# EAGLE design PCC_hat3 (EAGLE 9.2.2)
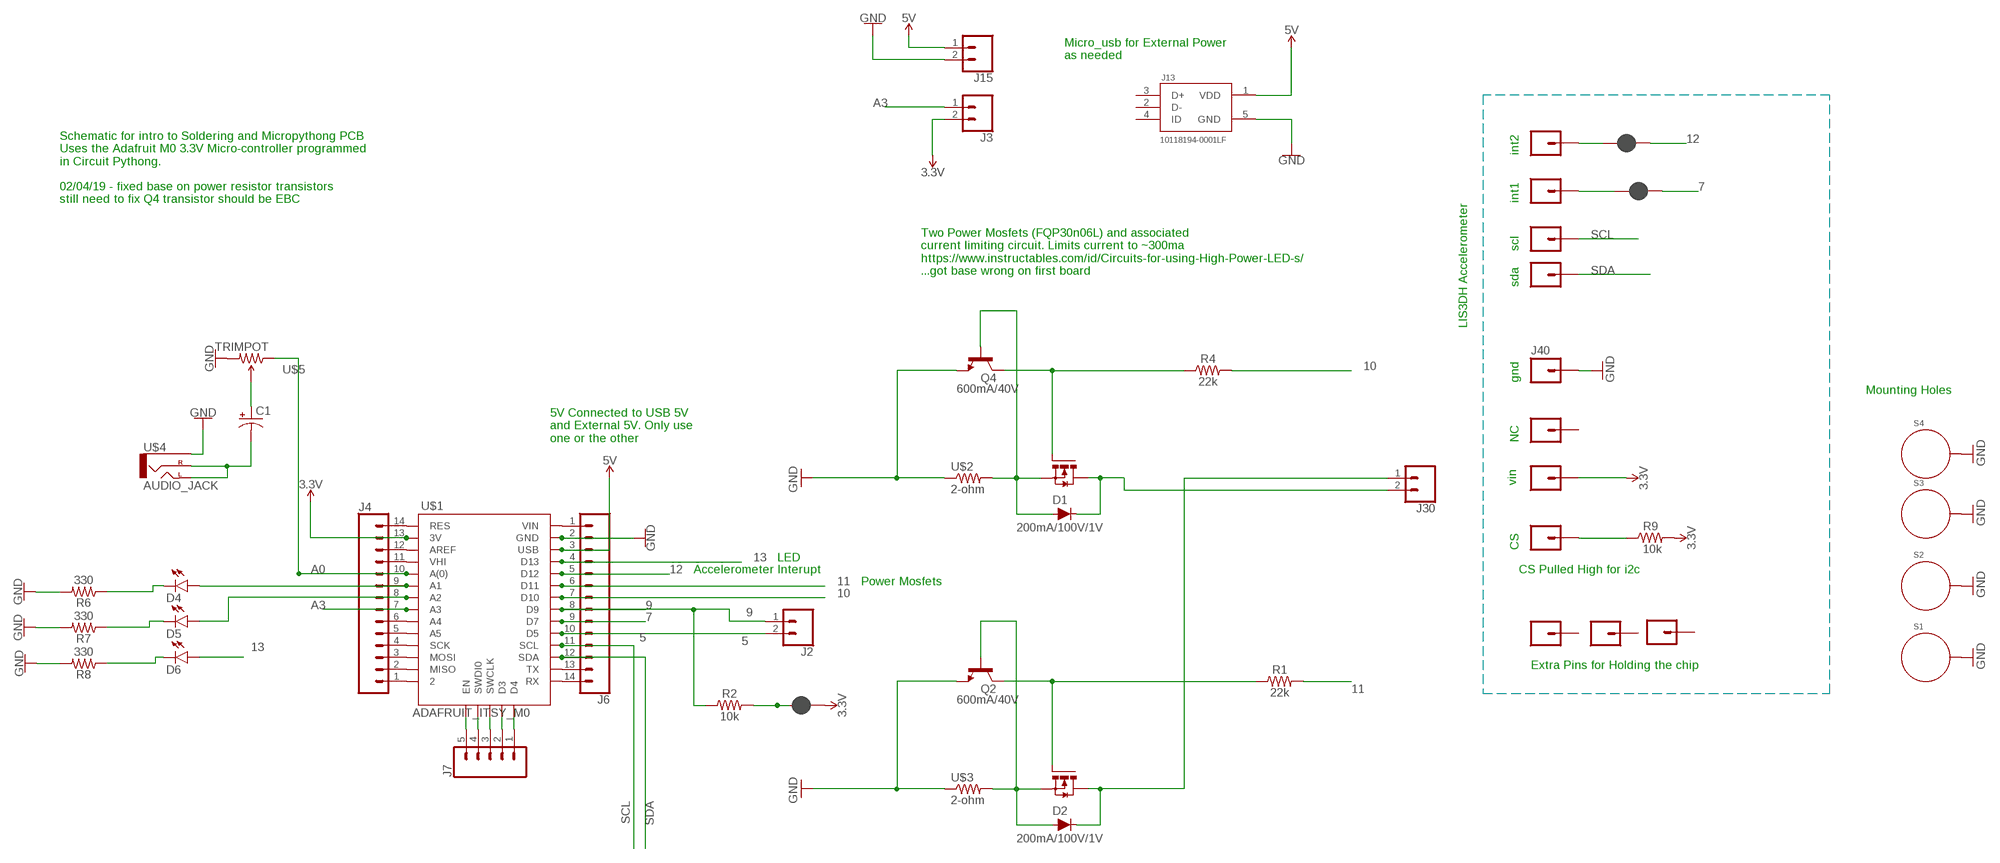
[diagram p0: schematic, sheet 1]

## Parts
C1  CAP_POLPTH1  [CPOL-RADIAL-100UF-25V]
D1  200mA/100V/1V  DIODE-KIT  [DIODE-1N4148-KIT]
D2  200mA/100V/1V  DIODE-KIT  [DIODE-1N4148-KIT]
D4  LED5MM  [LED5MM]
D5  LED5MM  [LED5MM]
D6  LED5MM  [LED5MM]
J2  CONN_025MM  [SCREWTERMINAL-5MM-2]
J3  CONN_025MM  [SCREWTERMINAL-5MM-2]
J4  CONN_14  [1X14]
J5  M01PTH  [1X01]
J6  CONN_14  [1X14]
J7  CONN_05  [1X05]
J8  M01PTH  [1X01]
J9  M01PTH  [1X01]
J10  M01PTH  [1X01]
J11  M01PTH  [1X01]
J12  M01PTH  [1X01]
J13  10118194-0001LF  [FRAMATOME_10118194-0001LF]
J15  CONN_025MM  [SCREWTERMINAL-5MM-2]
J30  CONN_025MM  [SCREWTERMINAL-5MM-2]
J39  M01PTH  [1X01]
J40  M01PTH  [1X01]
J42  M01PTH  [1X01]
J43  M01PTH  [1X01]
J44  M01PTH  [1X01]
JP1  JUMPER-SMT_2_NC_PASTE_SILK  [SMT-JUMPER_2_NC_PASTE_SILK]
JP2  JUMPER-SMT_2_NC_PASTE_SILK  [SMT-JUMPER_2_NC_PASTE_SILK]
JP3  JUMPER-SMT_2_NC_PASTE_SILK  [SMT-JUMPER_2_NC_PASTE_SILK]
Q1  IRFI540NPBF  [TO220BH]
Q2  600mA/40V  TRANS_NPN-P2N2222A  [TO-92]
Q3  IRFI540NPBF  [TO220BH]
Q4  600mA/40V  TRANS_NPN-P2N2222A  [TO-92]
R1  22k  RESISTORAXIAL-0.3-KIT  [AXIAL-0.3-KIT]
R2  10k  RESISTORAXIAL-0.3-KIT  [AXIAL-0.3-KIT]
R4  22k  RESISTORAXIAL-0.3-KIT  [AXIAL-0.3-KIT]
R6  330  RESISTORAXIAL-0.3-KIT  [AXIAL-0.3-KIT]
R7  330  RESISTORAXIAL-0.3-KIT  [AXIAL-0.3-KIT]
R8  330  RESISTORAXIAL-0.3-KIT  [AXIAL-0.3-KIT]
R9  10k  RESISTORAXIAL-0.3-KIT  [AXIAL-0.3-KIT]
S1  STANDOFF_ELECTRICAL  [STANDOFF-ELECTRICAL]
S2  STANDOFF_ELECTRICAL  [STANDOFF-ELECTRICAL]
S3  STANDOFF_ELECTRICAL  [STANDOFF-ELECTRICAL]
S4  STANDOFF_ELECTRICAL  [STANDOFF-ELECTRICAL]
U$1  ADAFRUIT_ITSY_M0  [ADAFRUIT_ITS_M0]
U$2  2-ohm  RESISTOR  [RESISTOR_5W_PT]
U$3  2-ohm  RESISTOR  [RESISTOR_5W_PT]
U$4  AUDIO_JACK  [1/8"AUDIO_JACK]
U$5  TRIMPOT  [1X03_TRIMPOT]

## Nets
3.3V: J3.2 J4.13 J5.1 JP3.2 R9.P$2 U$1.3V
5: J2.2 J6.10 U$1.D5
5V: J6.3 J13.1(VDD) J15.1 U$1.USB
7: J6.9 JP1.2 U$1.D7
9: J2.1 J6.8 R2.P$1 U$1.D9
10: J6.7 R4.P$2 U$1.D10
11: J6.6 R1.P$2 U$1.D11
12: J6.5 JP2.2 U$1.D12
13: D6.A J6.4 U$1.D13
A0: J4.10 U$1.A0(A(0)) U$5.1(CCW)
A3: J3.1 J4.7 U$1.A3
EXTERNAL_5V: J6.1 U$1.VIN
GND: J6.2 J13.5(GND) J15.2 J40.1 Q2.3(E) Q4.3(E) R6.P$2 R7.P$2 R8.P$2 S1.P1 S2.P1 S3.P1 S4.P1 U$1.GND U$2.P$1 U$3.P$1 U$4.GND(SLEEVE) U$5.3(CW)
N$1: JP3.1 R2.P$2
N$2: D4.K(C) R6.P$1
N$3: J7.1 U$1.D4
N$4: C1.2(-) U$4.LEFT_TIP_1(LEFT) U$4.RIGHT
N$5: J4.2 U$1.MISO
N$6: J4.3 U$1.MOSI
N$7: J4.4 U$1.SCK
N$8: J4.5 U$1.A5
N$9: J4.6 U$1.A4
N$10: C1.1(+) U$5.2(WIPER)
N$11: D5.A J4.8 U$1.A2
N$12: D4.A J4.9 U$1.A1
N$13: D5.K(C) R7.P$1
N$14: J4.11 U$1.VHI
N$15: J4.12 U$1.AREF
N$16: J4.14 U$1.RES
N$17: D2.C J30.1 Q1.D
N$18: D1.A Q3.S Q4.2(B) U$2.P$2
N$19: J11.1 JP2.1
N$20: D6.K(C) R8.P$1
N$21: J6.13 U$1.TX
N$22: J6.14 U$1.RX
N$23: J7.2 U$1.3(D3)
N$24: J7.3 U$1.SWCLK
N$25: J7.4 U$1.SWDI0
N$26: J7.5 U$1.EN
N$27: J44.1 JP1.1
N$28: J8.1 R9.P$1
N$30: D2.A Q1.S Q2.2(B) U$3.P$2
N$31: Q3.G Q4.1(C) R4.P$1
N$32: Q1.G Q2.1(C) R1.P$1
N$33: J4.1 U$1.2
N$71: D1.C J30.2 Q3.D
SCL: J6.11 J43.1 U$1.SCL
SDA: J6.12 J42.1 U$1.SDA
Unconnected: J9.1 J10.1 J12.1 J13.2(D-) J13.3(D+) J13.4(ID) J39.1

## Notes on the sheet
- Micro_usb for External Power
  as needed
- int2
- Schematic for intro to Soldering and Micropythong PCB
  Uses the Adafruit M0 3.3V Micro-controller programmed
  in Circuit Pythong.
  
  02/04/19 - fixed base on power resistor transistors
  still need to fix Q4 transistor should be EBC
- LIS3DH Accelerometer | int1
- scl
- Two Power Mosfets (FQP30n06L) and associated 
  current limiting circuit. Limits current to ~300ma
  https://www.instructables.com/id/Circuits-for-using-High-Power-LED-s/
  ...got base wrong on first board
- sda
- gnd
- Mounting Holes
- 5V Connected to USB 5V 
  and External 5V. Only use
  one or the other
- NC
- vin
- CS
- LED
- Accelerometer Interupt | CS Pulled High for i2c
- Power Mosfets
- Extra Pins for Holding the chip

## Library data of the parts
C1 = SparkFun-Passives:CAP_POL: Capacitor Polarized These are standard SMD and PTH capacitors. Normally 10uF, 47uF, and 100uF in electrolytic and tantalum varieties. Always verify the external diameter of the through hole cap, it varies with capacity, voltage, and manufacturer. The EIA devices should be standard.
D1 D2 = SparkFun-DiscreteSemi:DIODE: Diode These are standard reverse protection diodes and small signal diodes. SparkFun Products: SparkFun SparkPunk Sound Kit <https://www.sparkfun.com/products/11177> SparkFun ESP8266 Thing <https://www.sparkfun.com/products/13231>; PROD_ID: DIO-08378
D4-D6 = SparkFun-LED:LED: LEDs Standard schematic elements and footprints for 5mm, 3mm, 1206, and 0603 sized LEDs. 5mm - Spark Fun Electronics SKU : COM-00529 (and others)
J2 J3 J15 J30 = SparkFun-Connectors:CONN_02: Multi connection point. Often used as Generic Header-pin footprint for 0.1 inch spaced/style header connections On any of the 0.1 inch spaced packages, you can populate with these: Break Away Headers - Straight <https://www.sparkfun.com/products/116> (PRT-00116) Break Away Male Headers - Right Angle <https://www.sparkfun.com/products/553> (PRT-00553) Female Headers <https://www.sparkfun.com/products/115> (PRT-00115) Break Away Headers - Machine Pin <https://www.sparkfun.com/products/117> (PRT-00117) Break Away Female Headers - Swiss Machine Pin <https://www.sparkfun.com/products/743> (PRT-00743) For SCREWTERMINALS and SPRING TERMINALS visit here: Screw Terimnals on SparkFun.com <https://www.sparkfun.com/search/results?term=Screw+Terminals> (5mm/3.5mm/2.54mm spacing) This device is also useful as a general connection point to wire up your design to another part of your project. Our various solder wires solder well into these plated through hole pads. Hook-Up Wire - Assortment (Stranded, 22 AWG) <https://www.sparkfun.com/products/11375> (PRT-11375) Hook-Up Wire - Assortment (Solid Core, 22 AWG) <https://www.sparkfun.com/products/11367> (PRT-11367) View the entire wire category on our website here <https://www.sparkfun.com/categories/141> Special notes: Molex polarized connector foot print use with: PRT-08233 with associated crimp pins and housings. 2.54_SCREWTERM for use with PRT-10571. 3.5mm Screw Terminal footprints for PRT-08084 5mm Screw Terminal footprints for use with PRT-08432; SF_SKU: PRT-08432
J4 J6 = SparkFun-Connectors:CONN_14: Multi connection point. Often used as Generic Header-pin footprint for 0.1 inch spaced/style header connections On any of the 0.1 inch spaced packages, you can populate with these: Break Away Headers - Straight <https://www.sparkfun.com/products/116> (PRT-00116) Break Away Male Headers - Right Angle <https://www.sparkfun.com/products/553> (PRT-00553) Female Headers <https://www.sparkfun.com/products/115> (PRT-00115) Break Away Headers - Machine Pin <https://www.sparkfun.com/products/117> (PRT-00117) Break Away Female Headers - Swiss Machine Pin <https://www.sparkfun.com/products/743> (PRT-00743) For SCREWTERMINALS and SPRING TERMINALS visit here: Screw Terimnals on SparkFun.com <https://www.sparkfun.com/search/results?term=Screw+Terminals> (5mm/3.5mm/2.54mm spacing) This device is also useful as a general connection point to wire up your design to another part of your project. Our various solder wires solder well into these plated through hole pads. Hook-Up Wire - Assortment (Stranded, 22 AWG) <https://www.sparkfun.com/products/11375> (PRT-11375) Hook-Up Wire - Assortment (Solid Core, 22 AWG) <https://www.sparkfun.com/products/11367> (PRT-11367) View the entire wire category on our website here <https://www.sparkfun.com/categories/141> Special notes: Molex polarized connector foot print use with SKU : PRT-08231 with associated crimp pins and housings. 1MM SMD Version SKU: PRT-10208 NOTES ON THE VARIANTS LOCK and LOCK_LONGPADS... This footprint was designed to help hold the alignment of a through-hole component (i.e. 6-pin header) while soldering it into place. You may notice that each hole has been shifted either up or down by 0.005 of an inch from it's more standard position (which is a perfectly straight line). This slight alteration caused the pins (the squares in the middle) to touch the edges of the holes. Because they are alternating, it causes a "brace" to hold the component in place. 0.005 has proven to be the perfect amount of "off-center" position when using our standard breakaway headers. Although looks a little odd when you look at the bare footprint, once you have a header in there, the alteration is very hard to notice. Also,if you push a header all the way into place, it is covered up entirely on the bottom side.
J5 J8-J12 J39 J40 J42-J44 = SparkFun-Connectors:M01: Header 1 Standard 1-pin 0.1" header. Use with straight break away headers (SKU : PRT-00116), right angle break away headers (PRT-00553), swiss pins (PRT-00743), machine pins (PRT-00117), and female headers (PRT-00115). SMTSO-256-ET is a "flush mount" nut for a 4-40 screw. The older package used to be too tight, and did not allow it to sit properly thru the drill hit. The latest (0.165DIA) fits nice and snug.
J7 = SparkFun-Connectors:CONN_05: Multi connection point. Often used as Generic Header-pin footprint for 0.1 inch spaced/style header connections On any of the 0.1 inch spaced packages, you can populate with these: Break Away Headers - Straight <https://www.sparkfun.com/products/116> (PRT-00116) Break Away Male Headers - Right Angle <https://www.sparkfun.com/products/553> (PRT-00553) Female Headers <https://www.sparkfun.com/products/115> (PRT-00115) Break Away Headers - Machine Pin <https://www.sparkfun.com/products/117> (PRT-00117) Break Away Female Headers - Swiss Machine Pin <https://www.sparkfun.com/products/743> (PRT-00743) For SCREWTERMINALS and SPRING TERMINALS visit here: Screw Terimnals on SparkFun.com <https://www.sparkfun.com/search/results?term=Screw+Terminals> (5mm/3.5mm/2.54mm spacing) This device is also useful as a general connection point to wire up your design to another part of your project. Our various solder wires solder well into these plated through hole pads. Hook-Up Wire - Assortment (Stranded, 22 AWG) <https://www.sparkfun.com/products/11375> (PRT-11375) Hook-Up Wire - Assortment (Solid Core, 22 AWG) <https://www.sparkfun.com/products/11367> (PRT-11367) View the entire wire category on our website here <https://www.sparkfun.com/categories/141> Special notes: Molex polarized connector foot print use with SKU : PRT-08231 with associated crimp pins and housings. 1MM SMD Version SKU: PRT-10208
J13 = 10118194-0001LF:10118194-0001LF: Conn Micro USB Type B RCP 5 POS 0.65mm Solder RA SMD 5 Terminal 1 Port T/R; AVAILABILITY: Unavailable; DESCRIPTION: Micro Usb, 2.0 Type b, Rcpt, Smt; MF: Amphenol ICC; MP: 10118194-0001LF; PACKAGE: None; PRICE: None
JP1-JP3 = SparkFun-Jumpers:JUMPER-SMT_2_NC_PASTE: Normally closed solder jumper This jumper has an aperture in the stencil to allow solder paste to bridge the split in the wire so it's normally closed (NC). Wick off the solder to open the connection. Reapply solder to reclose the connection.
Q1 Q3 = transistor-power:IRFI540NPBF: HEXFET Power MOISFET VDSS = 100V, RDS(on) = 0.052 Ohm, ID = 20A, VGS(th) = 2.0 -- 4.0V Source: http://www.irf.com/product-info/datasheets/data/irfi540npbf.pdf
Q2 Q4 = SparkFun-DiscreteSemi:TRANS_NPN: NPN transistor Current controlled devices typically used to amplify current or used as a switch. BC547 - COM-08928 <http://www.sparkfun.com/products/8928> (TO-92 45V 100mA) (1.Collector 2.Base 3.Emitter) 2N3904 - COM-00521 <http://www.sparkfun.com/products/521> (TO-92 40V 200mA) (1.Emitter 2.Base 3.Collector) P2N2222A - COM-12852 <http://www.sparkfun.com/products/12852> (TO-92 40V 600mA) (1.Collector 2.Base 3.Emitter); PROD_ID: TRANS-09536
R1 R2 R4 R6-R9 = SparkFun-Resistors:RESISTOR: Generic Resistor Package
S1-S4 = th_libraries:STANDOFF_ELECTRICAL: A standoff intended to be an electrically connected point. Pad size and stop size allow for a #8 Phillips pan screw head to make a solid connection to the board.; SPICEPREFIX: X
U$1 = th_libraries:ADAFRUIT_ITSY_M0
U$2 U$3 = th_libraries:RESISTOR: 0.8" wide holes, 42mil diameter holes
U$4 = th_libraries:AUDIO_JACK
U$5 = th_libraries:TRIMPOT

## Net classes
1 HV: width 0.406 mm, drill 0.381 mm, clearance 1.016 mm

## Board
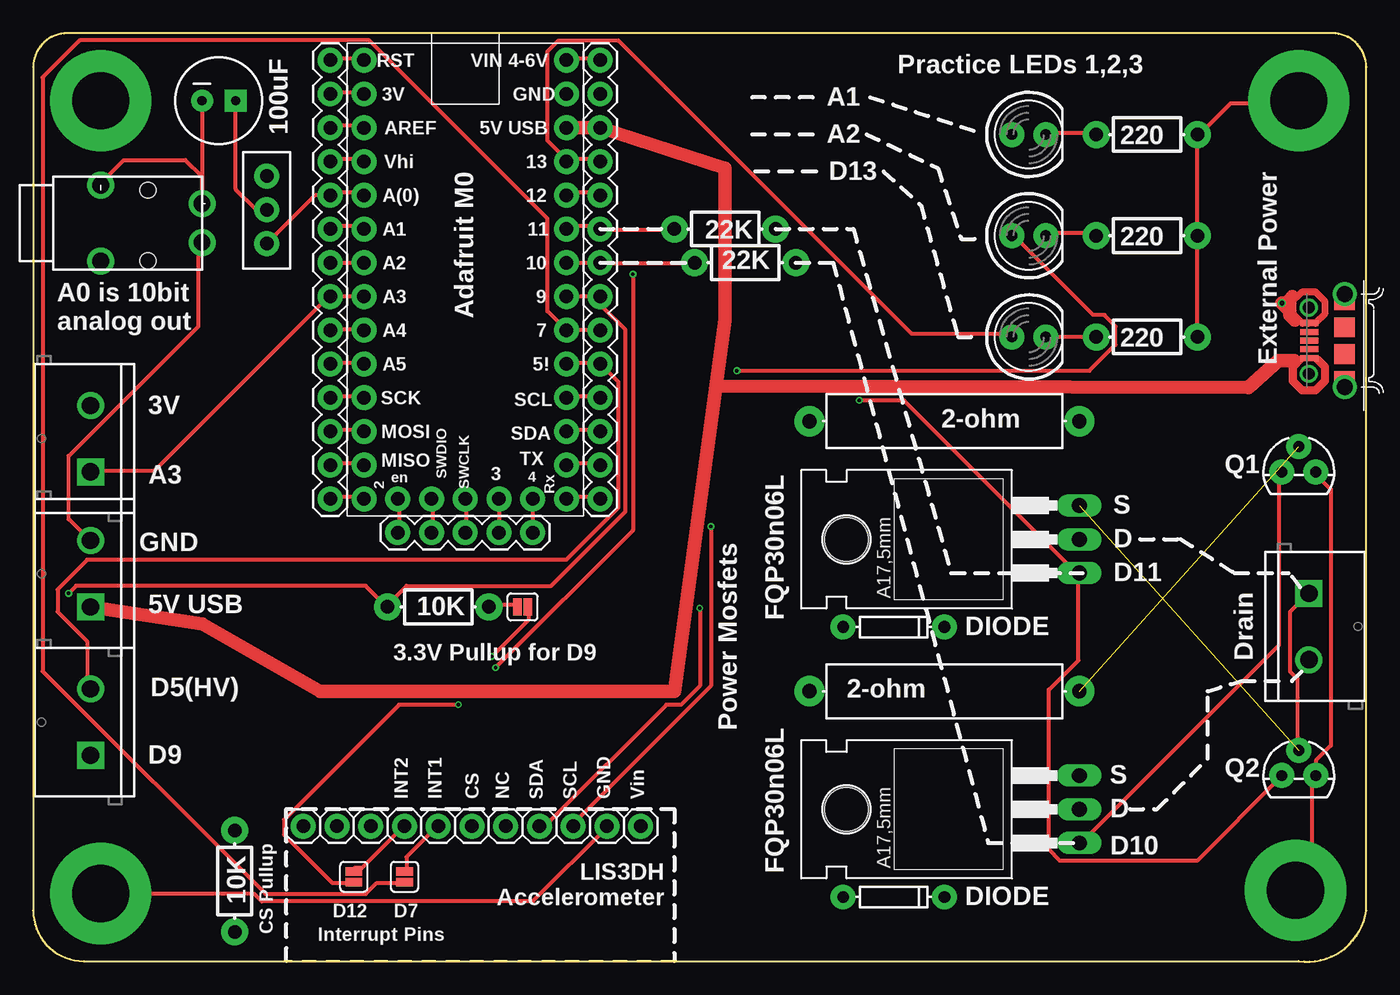
[diagram p1: board, top side]
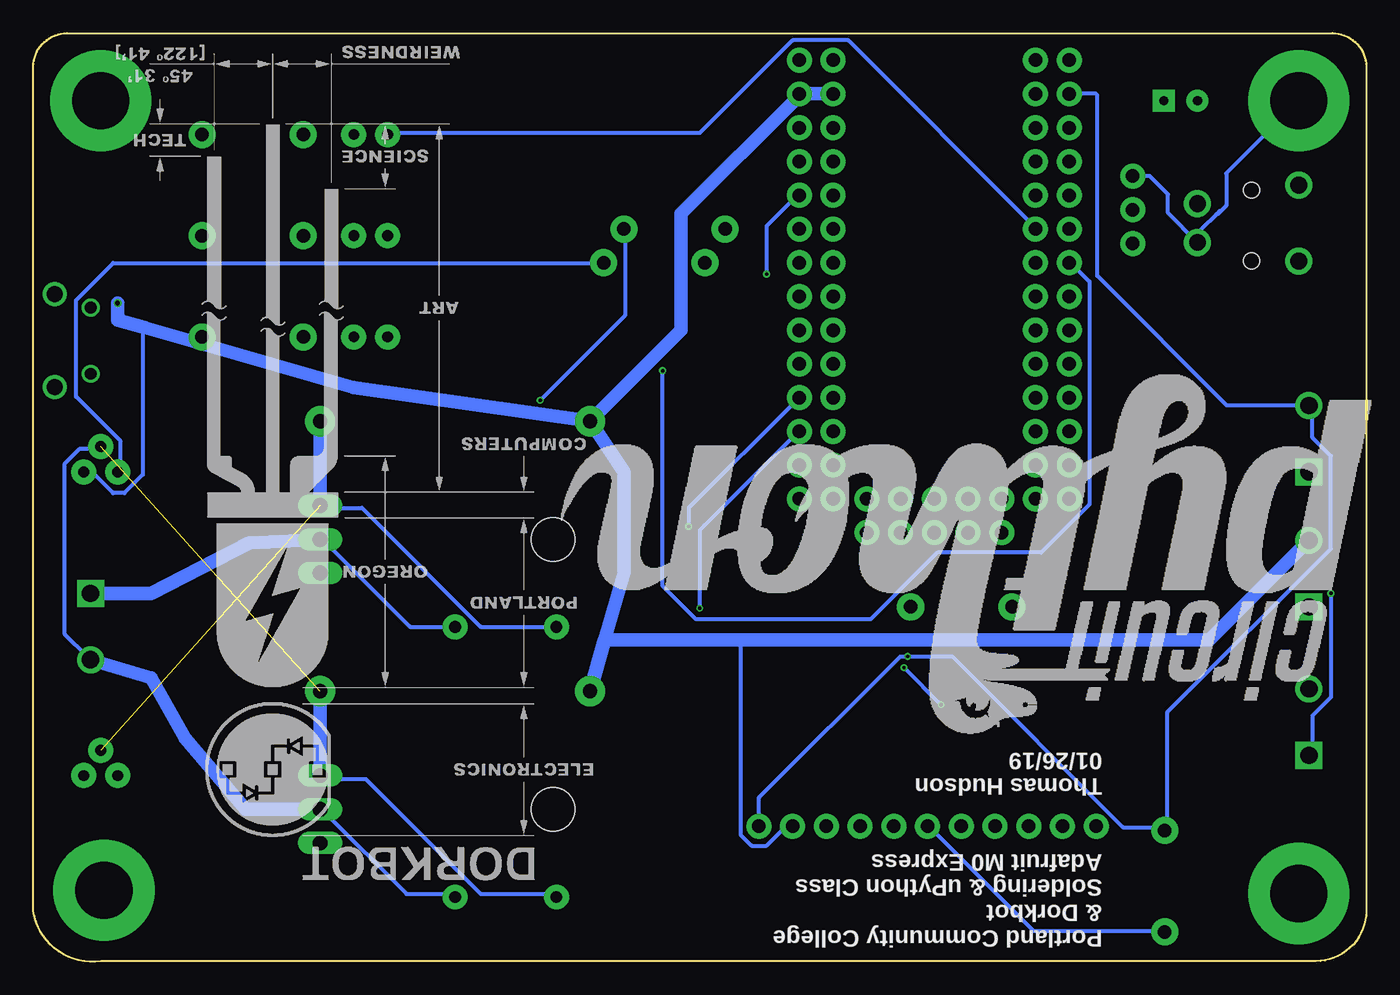
[diagram p2: board, bottom side, seen from below]

Size 100.33 x 69.89 mm. Coordinates in mm from the lower left corner, seen from the top.
Outline: 3.81,0.04 95.25,0.04 arc90 100.33,3.85 100.33,67.35 arc90 97.79,69.89 2.54,69.89 arc90 0,67.35 0,3.85 arc90 3.81,0.04
Copper layers (1*16): Top 0.035559375mm / dielectric 1.6mm / Bottom 0.035559375mm
Design rules "oshpark-2layer (1) *": minimum track width 12mil, minimum drill 10mil, track to track 10mil, track to pad 10mil, pad to pad 10mil, via to via 10mil, smd to smd 8mil, copper to edge 10mil, drill to drill 10mil, minimum pad ring 5mil, minimum via ring 5mil, stop-mask expansion 2.5mil, vias tented up to drill 35mil, thermal gap 10mil

### Footprints (pad centres in the part's own frame; a part is rotated, then mirrored left to right if it is on the bottom)
CPOL-RADIAL-100UF-25V = drill 0.7 pad 1.651 square: 1 1.27,0 | drill 0.7 pad 1.651: 2 -1.27,0
DIODE-1N4148-KIT = drill 0.9 pad 1.88: A -3.81,0; C 3.81,0
LED5MM = drill 0.813 pad 1.88: A -1.27,0; K 1.27,0
SCREWTERMINAL-5MM-2 = drill 1.3 pad 2.032 square: 1 0,0 | drill 1.3 pad 2.032: 2 5,0
1X14 = drill 1.016 pad 1.88: 1 0,0; 2 2.54,0; 3 5.08,0; 4 7.62,0; 5 10.16,0; 6 12.7,0; 7 15.24,0; 8 17.78,0; 9 20.32,0; 10 22.86,0; 11 25.4,0; 12 27.94,0; 13 30.48,0; 14 33.02,0
1X01 = drill 1.016 pad 1.88: 1 0,0
1X05 = drill 1.016 pad 1.88: 1 0,0; 2 2.54,0; 3 5.08,0; 4 7.62,0; 5 10.16,0
FRAMATOME_10118194-0001LF = smd 0.45 x 1.35: 1 -1.3,2.675; 2 -0.65,2.675; 3 0,2.675; 4 0.65,2.675; 5 1.3,2.675 | drill 0.9: P$6 -2.5,2.7; P$7 2.5,2.7 | drill 1.2: P$8 -3.5,0; P$9 3.5,0 | smd 1.5 x 1.55: P$10 -1,0; P$11 1,0; P$12 -3.05,0; P$13 3.05,0
SMT-JUMPER_2_NC_PASTE_SILK = smd 0.635 x 1.27: 1 -0.406,0; 2 0.406,0
TO220BH = drill 1.118 long: D 0,-6.35; G -2.54,-6.35; S 2.54,-6.35 | hole 3.302: 0,11.176
TO-92 = drill 0.813 pad 1.88: 1 -1.27,0; 2 0,1.905; 3 1.27,0
AXIAL-0.3-KIT = drill 1.016 pad 2.032: P$1 -3.81,0; P$2 3.81,0
STANDOFF-ELECTRICAL = drill 4.318 pad 7.62: P1 0,0
ADAFRUIT_ITS_M0 = drill 1.016 pad 1.88: 2 -7.62,-12.7; 3 2.54,-12.7; 3V -7.62,17.78; A0 -7.62,10.16; A1 -7.62,7.62; A2 -7.62,5.08; A3 -7.62,2.54; A4 -7.62,0; A5 -7.62,-2.54; AREF -7.62,15.24; D4 5.08,-12.7; D5 7.62,-2.54; D7 7.62,0; D9 7.62,2.54; D10 7.62,5.08; D11 7.62,7.62; D12 7.62,10.16; D13 7.62,12.7; EN -5.08,-12.7; GND 7.62,17.78; MISO -7.62,-10.16; MOSI -7.62,-7.62; RES -7.62,20.32; RX 7.62,-12.7; SCK -7.62,-5.08; SCL 7.62,-5.08; SDA 7.62,-7.62; SWCLK 0,-12.7; SWDI0 -2.54,-12.7; TX 7.62,-10.16; USB 7.62,15.24; VHI -7.62,12.7; VIN 7.62,20.32
RESISTOR_5W_PT = drill 1.067 pad 2.286: P$1 -10.16,0; P$2 10.16,0
1/8"AUDIO_JACK = drill 1.27 pad 2.032: GND 7.62,-4.318; LEFT_TIP_1 0,0; NC 0,-5.715; RIGHT 7.62,-1.397 | hole 1.2: 3.556,-0.381; 3.556,-5.715
1X03_TRIMPOT = drill 1.016 pad 1.88: 1 0,0; 2 2.54,0; 3 5.08,0

### Placement (x,y rotation side)
C1  13.97,64.81 0 top
D1  64.77,4.87 0 top
D2  64.77,25.19 0 top
D4  74.93,62.27 0 top
D5  74.93,54.65 0 top
D6  74.93,47.03 0 top
J2  4.32,15.53 90 top
J3  4.32,36.87 90 top
J4  22.35,34.84 90 top
J5  45.72,10.2 180 top
J6  42.67,67.86 270 top
J7  37.59,32.3 180 top
J8  33.02,10.2 0 top
J9  25.4,10.2 0 top
J10  22.86,10.2 0 top
J11  27.94,10.2 0 top
J12  20.32,10.2 0 top
J13  98.7,46.75 90 top
J15  4.32,26.71 90 top
J30  96.01,27.73 270 top
J39  35.56,10.2 180 top
J40  43.18,10.2 180 top
J42  38.1,10.2 180 top
J43  40.64,10.2 180 top
J44  30.48,10.2 180 top
JP1  27.94,6.39 270 top
JP2  24.13,6.39 270 top
JP3  36.83,26.71 0 top
Q1  72.39,31.79 90 top
Q2  95.25,14.01 0 top
Q3  72.39,11.47 90 top
Q4  95.25,36.87 0 top
R1  52.07,55.16 180 top
R2  30.48,26.71 0 top
R4  53.59,52.62 180 top
R6  83.82,62.27 0 top
R7  83.82,54.65 0 top
R8  83.82,47.03 0 top
R9  15.16,6.06 90 top
S1  95,5.37 90 top
S2  95.25,64.81 0 top
S3  5.08,64.81 0 top
S4  5.08,5.12 0 top
U$1  32.51,47.54 0 top
U$2  68.58,20.36 0 top
U$3  68.58,40.68 0 top
U$4  5.08,58.46 0 top
U$5  17.58,54.07 90 top

### Tracks (layer width: path | path; a pad name or v marks a point on that pad's centre or on a via)
3.3V  (via drill 0.25)
  Top 0.305: 21.95,64.89 22.23,65.17 J4.13 22.5,65.45 24.74,65.45 U$1.3V | v34.52,22.98 37.31,25.77 37.31,26.61 JP3.2
  Bottom 0.305: J5.1 45.69,10.4 45.69,12.36 35.08,22.98 v34.52,22.98 31.17,22.98 18.31,10.12 15.24,10.12 R9.P$2 14.96,10.12 14.96,18.79 2.67,31.08 2.67,38.06 4.06,39.46 4.06,41.7 J3.2 10.49,41.87 20.24,51.63 20.24,65.24 20.32,65.32 J4.13
5
  Top 0.305: U$1.D5 40.39,45.05 42.62,45.05 J6.10 44.02,43.65 44.02,34.15 40.11,30.24 4.06,30.24 1.83,28.01 1.83,26.33 4.06,24.09 4.06,20.74 J2.2
5V
  Top 0.305: J13.1 96.56,45.37
  Top 0.508: 96.68,45.32 96.63,45.37 96.56,45.37 97.19,44.74 97.19,43.76 96.49,43.07 95.51,43.07 94.82,43.76 94.82,44.74 95.45,45.37 95.02,45.37 94.9,45.25
  Top 0.61: 94.94,45.22 94.94,44.93 94.77,44.76 94.77,43.74 95.49,43.02 96.52,43.02 97.24,43.74 97.24,44.76 96.68,45.32
  Top 1.016: U$1.USB J6.3 52.07,59.73 52.07,48.3 51.39,43.31 | 51.39,43.31 48.26,20.36 21.59,20.36 12.7,25.44 J15.1 | 51.39,43.31 91.44,43.22 93.73,45.25 94.9,45.25 94.94,45.22
7
  Top 0.305: JP1.2 27.81,5.93 25.86,5.93 25.02,5.1 17.48,5.1 0.71,21.86 0.71,66.56 3.51,69.36 25.3,69.36 38.71,55.95 38.71,48.96 U$1.D7 40.39,47.56 42.62,47.56 J6.9
9  (via drill 0.25)
  Top 0.305: U$1.D9 J6.8 42.9,50.08 42.9,49.24 44.58,47.56 44.58,33.87 38.99,28.29 28.09,28.29 26.7,26.89 R2.P$1 26.42,26.89 25.02,28.29 3.23,28.29 v2.67,27.73
  Bottom 0.305: v2.67,27.73 2.67,19.9 4.06,18.51 4.06,15.71 J2.1
10
  Top 0.305: U$1.D10 40.39,52.59 42.62,52.59 J6.7 42.9,52.59 49.61,52.59 R4.P$2
11
  Top 0.305: U$1.D11 40.39,55.39 42.62,55.39 J6.6 42.9,55.11 48.21,55.11 R1.P$2
12  (via drill 0.25)
  Top 0.305: v32,19.34 27.53,19.34 18.87,10.68 18.87,9.57 22.5,5.93 23.9,5.93 JP2.2 | v34.8,22.14 45.14,32.48 v45.14,51.76 | U$1.D12 40.39,57.9 42.62,57.9 J6.5
  Bottom 0.305: v34.8,22.14 v32,19.34 | v45.14,51.76 45.14,55.39 42.9,57.62 J6.5
13
  Top 0.305: J6.4 42.62,60.42 40.39,60.42 U$1.D13 40.11,60.42 38.71,61.81 38.71,68.52 39.55,69.36 44.02,69.36 66.09,47.28 73.63,47.28 D6.A
A0
  Top 0.305: J4.10 22.5,57.9 24.74,57.9 U$1.A0 | 22.23,57.9 J4.10 | J4.10 21.21,57.7 U$5.1
A3
  Top 0.305: U$1.A3 J4.7 22.23,50.08 9.09,36.95 4.34,36.95 J3.1
EXTERNAL_5V
  Top 0.305: U$1.VIN 40.39,67.96 42.62,67.96 J6.1
GND  (via drill 0.35)
  Top 0.305: 5.18,64.89 S3.P1 | S1.P1 95.15,5.37 96.27,6.49 96.27,13.76 Q2.3 96.55,14.04 96.55,15.15 97.66,16.27 97.66,35.55 96.55,36.67 Q4.3 | J13.5 95.99,48.12 95.99,48.07 | R8.P$2 87.6,47.28 87.6,54.55 R7.P$2 87.6,54.83 87.6,62.09 R6.P$2 87.88,62.37 90.12,64.61 95.15,64.61 S2.P1 | S4.P1 5.18,5.1 16.64,5.1 17.2,4.54 37.59,4.54 43.18,10.12 J40.1 | U$4.GND 12.45,53.99 12.45,47.84 2.67,38.06 2.67,33.31 4.06,31.92 J15.2
  Top 0.508: 94.77,50.05 95.13,50.05 95.51,50.43 96.49,50.43 97.19,49.74 97.19,48.76 96.49,48.07 95.99,48.07 95.51,48.07 95.29,48.3 95.25,48.3 94.94,48.29
  Top 1.016: v93.98,49.57 94.57,48.98 | 94.57,48.98 94.57,48.66 94.94,48.29 | 94.57,48.98 94.57,49.85 94.77,50.05
  Bottom 0.305: 11.05,56.51 11.27,56.29 | 11.27,56.29 12.45,55.11 12.45,54.27 U$4.GND 14.94,56.38 14.94,57.78 16.31,59.15 U$5.3 | 88,46.59 87.88,47.01 R8.P$2 | 47.09,24.22 47.09,9.57 46.25,8.73 45.14,8.73 43.74,10.12 43.18,10.12 J40.1 | Q4.3 96.27,36.67 95.71,36.67 94.31,35.27 93.47,35.27 92.08,36.67 92.08,47.28 91.95,47.72 | S3.P1 10.54,59.35 10.54,56.91 11.16,56.29 11.27,56.29
  Bottom 1.016: U$2.P$1 57.32,24.22 | 57.32,24.22 55.88,29.25 55.88,36.87 U$3.P$1 | 57.32,24.22 47.09,24.22 11.81,24.22 J15.2 | U$1.GND J6.2 42.67,65.19 51.56,56.3 51.56,47.54 U$3.P$1 | U$3.P$1 76.2,43.22 88,46.59 91.95,47.72 93.98,48.3 v93.98,49.57
N$1
  Top 0.305: JP3.1 36.2,26.89 34.52,26.89 R2.P$2
N$2
  Top 0.305: D4.K 76.43,62.37 79.78,62.37 R6.P$1
N$3
  Top 0.305: U$1.D4 J7.1
N$4
  Top 0.305: C1.2 U$4.RIGHT 12.7,59.1 11.46,60.34 11.43,60.32 6.78,60.32 5.08,58.61 U$4.LEFT_TIP_1
N$5
  Top 0.305: J4.2 22.5,37.51 24.74,37.51 U$1.MISO
N$6
  Top 0.305: J4.3 22.5,40.02 24.74,40.02 U$1.MOSI
N$7
  Top 0.305: J4.4 22.5,42.54 24.74,42.54 U$1.SCK
N$8
  Top 0.305: J4.5 22.5,45.05 24.74,45.05 U$1.A5
N$9
  Top 0.305: J4.6 22.5,47.56 24.74,47.56 U$1.A4
N$10
  Top 0.305: U$5.2 16.76,56.61 15.24,58.13 C1.1
N$11  (via drill 0.25)
  Top 0.305: J4.8 22.5,52.59 24.74,52.59 U$1.A2 | v52.96,44.49 79.5,44.49 81.46,46.45 81.46,47.84 80.62,48.68 79.78,48.68 73.91,54.55 D5.A
  Bottom 0.305: v52.96,44.49 52.96,28.29 50.44,25.77 37.31,25.77 32.28,30.8 24.46,30.8 20.83,34.43 20.83,51.2 22.23,52.59 J4.8
N$12
  Top 0.305: J4.9 22.5,55.39 24.74,55.39 U$1.A1
  Bottom 0.305: D4.A 73.63,62.37 50.17,62.37 43.18,69.36 38.99,69.36 25.02,55.39 U$1.A1
N$13
  Top 0.305: D5.K 76.43,54.83 79.78,54.83 R7.P$1
N$14
  Top 0.305: J4.11 22.5,60.42 24.74,60.42 U$1.VHI
N$15
  Top 0.305: J4.12 22.5,62.93 24.74,62.93 U$1.AREF
N$16
  Top 0.305: J4.14 22.5,67.96 24.74,67.96 U$1.RES
N$17
  Top 0.305: 95.15,15.99 95.15,21.3 94.59,21.86 94.59,26.33 95.99,27.73 J30.1
  Bottom 0.305: D2.C 68.61,25.21 71.96,25.21 78.38,31.64 Q1.D
  Bottom 1.016: Q1.D 84.07,31.54 91.44,27.73 J30.1
N$18  (1 unrouted)
  Bottom 0.305: D1.A 61.06,5.1 66.65,5.1 75.31,13.76 78.38,13.76 Q3.S
  Bottom 1.016: Q3.S U$2.P$2
N$19
  Top 0.305: JP2.1 24.18,7.05 24.74,7.05 27.81,10.12 J11.1
N$20
  Top 0.305: D6.K 76.43,47.01 79.78,47.01 R8.P$1
N$21
  Top 0.305: U$1.TX 40.39,37.51 42.62,37.51 J6.13
N$22
  Top 0.305: U$1.RX 40.39,34.99 42.62,34.99 J6.14
N$23
  Top 0.305: J7.2 35.08,32.48 35.08,34.71 U$1.3
N$24
  Top 0.305: J7.3 32.56,32.48 32.56,34.71 U$1.SWCLK
N$25
  Top 0.305: J7.4 30.05,32.48 30.05,34.71 U$1.SWDI0
N$26
  Top 0.305: J7.5 27.53,32.48 27.53,34.71 U$1.EN
N$27
  Top 0.305: JP1.1 28.09,7.05 28.09,7.89 30.33,10.12 J44.1
N$28
  Bottom 0.305: J8.1 32.84,10.12 25.02,2.3 15.24,2.3 R9.P$1
N$30  (1 unrouted)
  Bottom 0.305: D2.A 61.06,25.21 66.65,25.21 75.59,34.15 78.38,34.15 Q1.S
  Bottom 1.016: Q1.S U$3.P$2
N$31
  Top 0.305: Q3.G 78.94,9.01 93.75,23.82 93.75,36.67 Q4.1
  Bottom 0.305: R4.P$1 57.43,52.59 94.31,52.59 97.1,49.8 97.1,42.54 93.75,39.18 93.75,36.95 Q4.1
N$32  (via drill 0.25)
  Top 0.305: 78.66,29.12 78.66,22.7 76.43,20.46 76.43,8.45 77.27,7.61 87.6,7.61 93.75,13.76 Q2.1 | v62.18,42.26 65.53,42.26 78.66,29.12 | 78.66,29.12 Q1.G
  Bottom 0.305: v62.18,42.26 55.75,48.68 55.75,55.11 R1.P$1
N$33
  Top 0.305: J4.1 22.5,34.99 24.74,34.99 U$1.2
N$71
  Bottom 0.305: D1.C 68.61,5.1 72.24,5.1 78.38,11.24 Q3.D | 95.43,38.62 96.82,38.62 97.94,37.51 97.94,24.65 96.27,22.98 J30.2
  Bottom 1.016: Q3.D 84.33,11.47 88.9,16.8 91.44,21.38 J30.2
SCL  (via drill 0.25)
  Top 0.305: v51,32.76 51,20.74 40.67,10.4 J43.1 | U$1.SCL 40.39,42.54 42.62,42.54 J6.11
  Bottom 0.305: v51,32.76 51,34.15 42.9,42.26 J6.11
SDA  (via drill 0.25)
  Top 0.305: v50.17,26.61 50.17,20.74 48.77,19.34 47.65,19.34 38.71,10.4 38.15,10.4 J42.1 | U$1.SDA 40.39,40.02 42.62,40.02 J6.12
  Bottom 0.305: v50.17,26.61 50.17,32.48 42.9,39.74 J6.12

### Text on the board
tPlace: Practice LEDs 1,2,3 | A1 | A2 | 100uF | 220 | D13 | External Power | 22K | 220 | 22K | A0 is 10bit / analog out | 220 | 3V | 2-ohm | A3 | Q1 | S | GND | Power Mosfets | D | D11 | 10K | 5V USB | FQP30n06L | DIODE | 3.3V Pullup for D9 | Drain | D5(HV) | 2-ohm | D9 | S | Q2 | INT2 | INT1 | CS | NC | SDA | SCL | GND | Vin | D | D10 | LIS3DH / Accelerometer | FQP30n06L | 10K | D12 | D7 | DIODE | CS Pullup | Interrupt Pins
bPlace: Portland Community College / & Dorkbot / Soldering & uPython Class / Adafruit M0 Express / / / Thomas Hudson / 01/26/19
Badge_Outline: 32 | 32 | GND | 5V | 32 | 32 | 31 | GND | 5V | 31 | 30 | 30 | 29 | 29 | 28 | 28 | 27 | 27 | 26 | 26 | 25 | 25 | 24 | 24 | 23 | 23 | 22 | 22 | 21 | 21 | 20 | 20 | 19 | 19 | 18 | 18 | 17 | 17 | 16 | 16 | 15 | 15 | 14 | 14 | 13 | 13 | 12 | 12 | 11 | 11 | 10 | 10 | 9 | 9 | 8 | 8 | 7 | 7 | 6 | 6 | 5 | 5 | 4 | 4 | 3 | LD | CLK | MISO | 3 | 2 | LD | CLK | MISO | 1 | 2 | 1 | 1 | 1